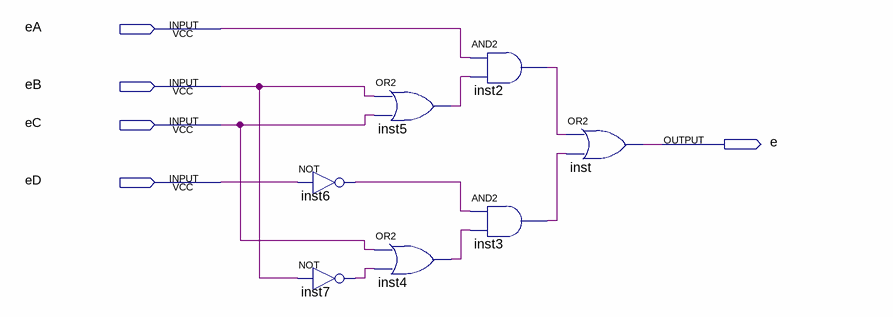
[diagram p0: schematic sheet]
// Quartus schematic segmentoE.bdf as structural Verilog: 7 symbols, 5 pins
module segmentoE (
  input  eA,
  input  eB,
  input  eC,
  input  eD,
  output e
);

  wire inst2_out, inst3_out, inst4_out, inst5_out, inst6_out, inst7_out;

  not inst6 (inst6_out, eD);
  not inst7 (inst7_out, eB);
  or inst5 (inst5_out, eB, eC);
  or inst4 (inst4_out, eC, inst7_out);
  and inst2 (inst2_out, eA, inst5_out);
  and inst3 (inst3_out, inst6_out, inst4_out);
  or inst (e, inst2_out, inst3_out);
endmodule
